# Altium schematic sheet top.SchDoc
size A4
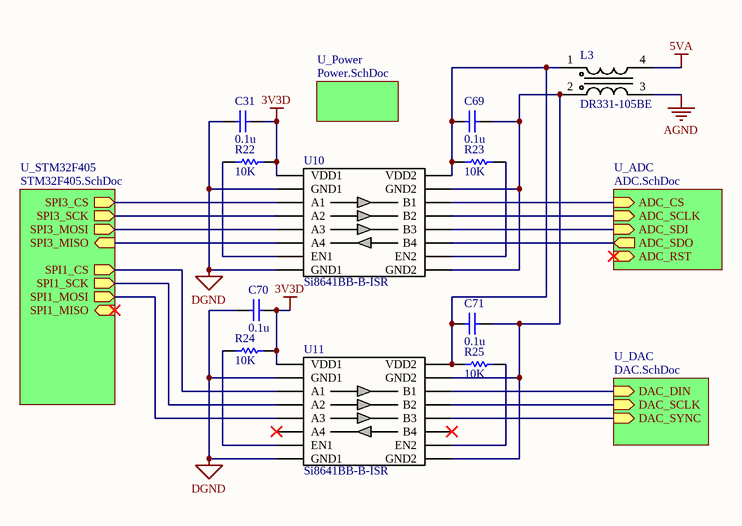
[diagram p0: top.SchDoc]

## Parts
C31  value 0.1u  [CAPC1608X90N]  (hidden comment: Cap)
C69  value 0.1u  [CAPC1608X90N]  (hidden comment: Cap)
C70  value 0.1u  [CAPC1608X90N]  (hidden comment: Cap)
C71  value 0.1u  [CAPC1608X90N]  (hidden comment: Cap)
L3  DR331-105BE  [DR331-105BE]
R22  value 10K  [RESC1608X55N]  (hidden comment: Res1)
R23  value 10K  [RESC1608X55N]  (hidden comment: Res1)
R24  value 10K  [RESC1608X55N]  (hidden comment: Res1)
R25  value 10K  [RESC1608X55N]  (hidden comment: Res1)
U10  Si8641BB-B-ISR  [SOIC127P600X175-16AN]
U11  Si8641BB-B-ISR  [SOIC127P600X175-16AN]

## Sub-sheets
U_ADC = ADC.SchDoc: ADC_SCLK (in), ADC_SDO (out), ADC_CS (in), ADC_SDI (in), ADC_RST (in)
U_DAC = DAC.SchDoc: DAC_SYNC (in), DAC_SCLK (in), DAC_DIN (in)
U_Power = Power.SchDoc: no entries
U_STM32F405 = STM32F405.SchDoc: SPI3_MOSI (out), SPI3_MISO (in), SPI3_SCK (out), SPI1_MOSI (out), SPI1_MISO (in), SPI1_SCK (out), SPI1_CS (out), SPI3_CS (out)

## Nets
3V3D: C31.1 C70.1 R22.2 R24.2 U10.1(VDD1) U11.1(VDD1)
5VA: L3.4(VOUT+)
AGND: L3.3(VOUT+)
DGND: C31.2 C70.2 U10.2(GND1) U10.8(GND1) U11.2(GND1) U11.8(GND1)
NetC69_1: C69.1 C71.2 L3.1(VOUT+) R23.1 R25.1 U10.16(VDD2) U11.16(VDD2)
NetC69_2: C69.2 C71.1 L3.2(VOUT+) U10.9(GND2) U10.15(GND2) U11.9(GND2) U11.15(GND2)
NetR22_1: R22.1 U10.7(EN1)
NetR23_2: R23.2 U10.10(EN2)
NetR24_1: R24.1 U11.7(EN1)
NetR25_2: R25.2 U11.10(EN2)
NetU10_3: U10.3(A1) ; sheet U_STM32F405/SPI3_CS
NetU10_4: U10.4(A2) ; sheet U_STM32F405/SPI3_SCK
NetU10_5: U10.5(A3) ; sheet U_STM32F405/SPI3_MOSI
NetU10_6: U10.6(A4) ; sheet U_STM32F405/SPI3_MISO
NetU10_11: U10.11(B4) ; sheet U_ADC/ADC_SDO
NetU10_12: U10.12(B3) ; sheet U_ADC/ADC_SDI
NetU10_13: U10.13(B2) ; sheet U_ADC/ADC_SCLK
NetU10_14: U10.14(B1) ; sheet U_ADC/ADC_CS
NetU11_3: U11.3(A1) ; sheet U_STM32F405/SPI1_CS
NetU11_4: U11.4(A2) ; sheet U_STM32F405/SPI1_SCK
NetU11_5: U11.5(A3) ; sheet U_STM32F405/SPI1_MOSI
NetU11_12: U11.12(B3) ; sheet U_DAC/DAC_SYNC
NetU11_13: U11.13(B2) ; sheet U_DAC/DAC_SCLK
NetU11_14: U11.14(B1) ; sheet U_DAC/DAC_DIN

Not connected (* = marked no-connect by the designer): U11 6(A4)* 11(B4)*

## Library data of the parts
C31 C69-C71 = Cap: Capacitor; Published: 8-Jun-2000; LatestRevisionDate: 17-Jul-2002; LatestRevisionNote: Re-released for DXP Platform.; PackageReference: RAD-0.3; Publisher: Altium Limited; PackageDescription: Radial Cap, Thru-Hole; 2 Leads; 0.3 in Pin Spacing
L3 = DR331-105BE: Common mode choke 1mH 0.5A
R22-R25 = Res1: Resistor; Published: 8-Jun-2000; LatestRevisionDate: 17-Jul-2002; LatestRevisionNote: Re-released for DXP Platform.; PackageReference: AXIAL-0.3; Publisher: Altium Limited; PackageDescription: Axial Device, Thru-Hole; 2 Leads; 0.3 in Pin Spacing
U10 U11 = Si8641BB-B-ISR: isolator for SPI 3 forward 1 reverse isolator